# Altium schematic sheet CDCDCDC_5V.SchDoc
size A4
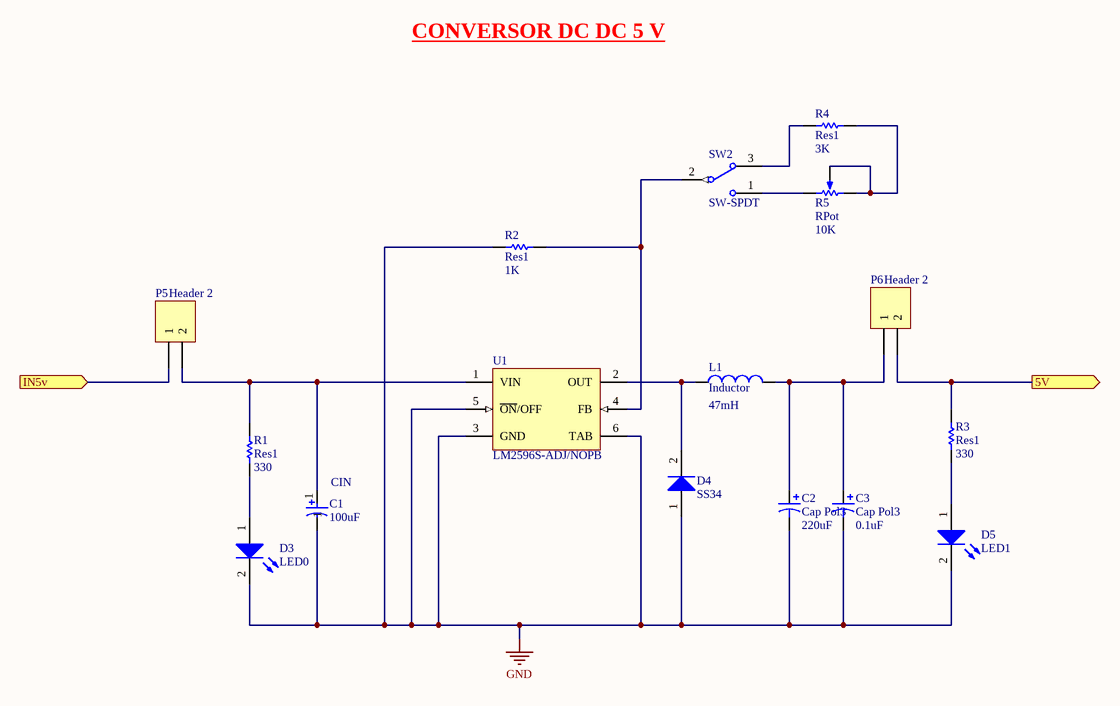
[diagram p0: CDCDCDC_5V.SchDoc]

## Parts
C1  100uF  [NIC-UWT1H101MNL1GS_N]
C2  Cap Pol3  value 220uF  [1812]
C3  Cap Pol3  value 0.1uF  [1812]
D3  LED0  [LED-0]
D4  SS34  [SMC]
D5  LED1  [LED-0]
L1  Inductor  value 47mH  [0402-A]
P5  Header 2  [HDR1X2]
P6  Header 2  [HDR1X2]
R1  Res1  value 330  [AXIAL-0.3]
R2  Res1  value 1K  [AXIAL-0.3]
R3  Res1  value 330  [AXIAL-0.3]
R4  Res1  value 3K  [AXIAL-0.3]
R5  RPot  value 10K  [VR5]
SW2  SW-SPDT  [TL36WW15050]
U1  LM2596S-ADJ/NOPB  [KTT0005B_N]

## Ports
5V (out), IN5v (in)

## Nets
GND: C1.2 C2.2 C3.2 D3.2(K) D4.1(A) D5.2(K) R2.2 U1.3(GND) U1.5(~{ON}/OFF) U1.6(TAB)
5V: P6.2 R3.2 ; port 5V
IN5v: P5.1 ; port IN5v
NetC1_1: C1.1 P5.2 R1.2 U1.1(VIN)
NetC2_1: C2.1 C3.1 L1.2 P6.1
NetD3_1: D3.1(A) R1.1
NetD4_2: D4.2(K) L1.1 U1.2(OUT)
NetD5_1: D5.1(A) R3.1
NetR2_1: R2.1 SW2.2 U1.4(FB)
NetR4_1: R4.1 R5.1(TOP) R5.3(TAP)
NetR4_2: R4.2 SW2.3
NetR5_2: R5.2(BOT) SW2.1

## Notes on the sheet
- CONVERSOR DC DC 5 V
- (near C1) CIN

## Library data of the parts
C1 = CMP-2000-07373-1: Aluminum Electrolytic Capacitor, 100 uF, +/- 20%, 50 V, -55 to 105 degC, 2-Pin SMD, RoHS, Tape and Reel; Manufacturer: Nichicon; Capacitance: 100µF; Type: Can; Rated Voltage: 50V; Datasheet Version: 08/2015; Operating Temp-Max: 105°C; Mounting Technology: SurfaceMount; Datasheet URL: http://products.nichicon.co.jp/en/pdf/XJA043/e-uwt.pdf; Package Description: Aluminum Electrolytic Capacitor, Body 8.3 x 8.3 mm, Height 10.8 mm; Package Reference: UWT1H101MNL1GS; Case Size/Dimension: Ø8x10mm; Manufacturer URL: http://www.nichicon.co.jp/english/
C2 C3 = Cap Pol3: Polarized Capacitor (Surface Mount); Published: 8-Jun-2000; LatestRevisionDate: 29-May-2009; LatestRevisionNote: IPC-7351 Footprint Added.; PackageReference: C0805; Publisher: Altium Limited; PackageDescription: Chip Capacitor
D3 D5 = LED0: Typical INFRARED GaAs LED; Published: 8-Jun-2000; LatestRevisionDate: 08-Jul-2005; LatestRevisionNote: Mech Layer 1 removed.; PackageReference: LED-0; Publisher: Altium Limited; PackageDescription: LED; 2 Leads
D4 = Diode: Default Diode; Published: 8-Jun-2000; LatestRevisionDate: 17-Jul-2002; LatestRevisionNote: Re-released for DXP Platform.; PackageVersion: Sep-1996; PackageReference: SMC; Publisher: Altium Limited; PackageDescription: DO-214-AB/SMC; 2 C-Bend Leads; Body 7.9 x 5.9 mm, inc. leads (LxW); Code_JEDEC: DO-214-AB
L1 = Inductor: Code_IEC: 1005; Published: 8-Jun-2000; LatestRevisionDate: 29-May-2009; LatestRevisionNote: IPC-7351 Footprint Added.; PackageReference: 0402-A; Publisher: Altium Limited; PackageDescription: Chip Inductor; Code_JEITA: 0402
P5 P6 = Header 2: Header, 2-Pin; LatestRevisionDate: 17-Jul-2002; LatestRevisionNote: Re-released for DXP Platform.; Publisher: Altium Limited
R1-R4 = Res1: Resistor; Published: 8-Jun-2000; LatestRevisionDate: 17-Jul-2002; LatestRevisionNote: Re-released for DXP Platform.; PackageReference: AXIAL-0.3; Publisher: Altium Limited; PackageDescription: Axial Device, Thru-Hole; 2 Leads; 0.3 in Pin Spacing
R5 = RPot: Potentiometer; Sim Note: Enter the Resistance value and the set point into parameter fields.; Set Position: 0.5; Published: 8-Jun-2000; LatestRevisionDate: 17-Jul-2002; LatestRevisionNote: Re-released for DXP Platform.; PackageReference: VR5; Publisher: Altium Limited; PackageDescription: Variable Resistor, Thru-Hole; 3 Leads
SW2 = SW-SPDT: SPDT Subminiature Toggle Switch, Right Angle Mounting, Vertical Actuation; Published: 24-Mar-1999; LatestRevisionDate: 17-Dec-2003; LatestRevisionNote: Schematic revised, PCB Footprint replaced.; DatasheetVersion: 05-Dec-2000; PackageReference: TL36WW15050; Publisher: Altium Limited; PackageDescription: Switch; 4 Leads; ComponentLink1Description: Manufacturer Link; ComponentLink1URL: http://www.apem.com
U1 = CMP-0069-00271-3: SIMPLE SWITCHER® Power Converter 150 KHz 3A Step-Down Voltage Regulator, 5-pin TO-263, Pb-Free; Manufacturer: Texas Instruments; PowerWise: N; PackageTopMarking: NSUZXYTTE#*LM2596S*-ADJ P+; ComponentLink1Description: Datasheet URL; PackageDescription: TO-263, Molded, .400 x .390 x .180in, 5 Lead, .067in Pitch, Surface Mount; ComponentLink1URL: http://www.ti.com/general/docs/lit/getliterature.tsp?genericPartNumber=LM2596&fileType=pdf; Code_JEDEC: MO-169-AB; PinCount: 5; CompType: Switcher; PackageReference: KTT0005B; RoHS: Y